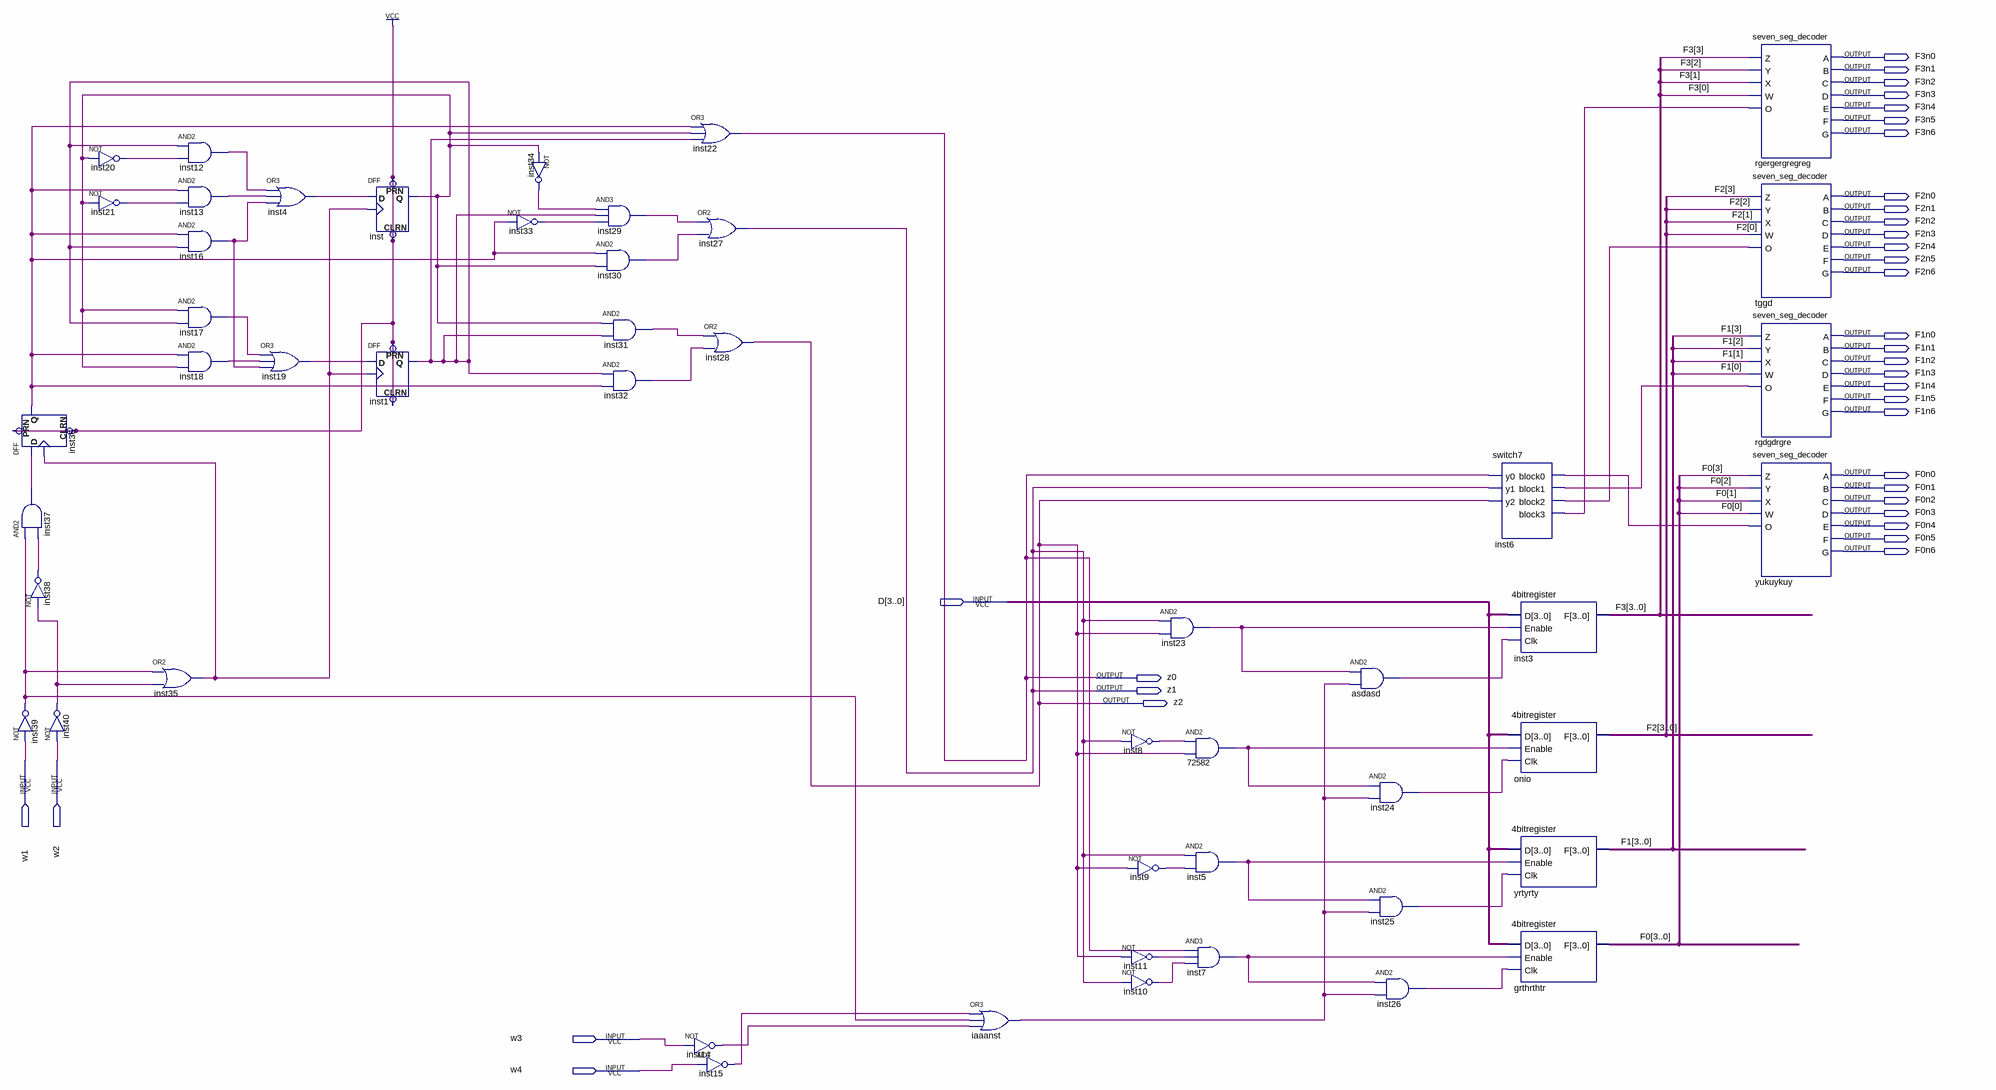
[diagram p0: schematic sheet]
// Quartus schematic DEC1.bdf as structural Verilog: 50 symbols, 36 pins
module DEC1 (
  input  [3:0] D,
  input  w1,
  input  w2,
  input  w3,
  input  w4,
  output F3n0,
  output F3n1,
  output F3n2,
  output F3n3,
  output F3n4,
  output F3n5,
  output F3n6,
  output F2n0,
  output F2n1,
  output F2n2,
  output F2n3,
  output F2n4,
  output F2n5,
  output F2n6,
  output F1n0,
  output F1n1,
  output F1n2,
  output F1n3,
  output F1n4,
  output F1n5,
  output F1n6,
  output F0n0,
  output F0n1,
  output F0n2,
  output F0n3,
  output F0n4,
  output F0n5,
  output F0n6,
  output z0,
  output z1,
  output z2
);

  wire asdasd_out, iaaanst_out, inst1_q, inst4_out, inst5_out, inst6_block0, inst6_block1, inst6_block2,
       inst6_block3, inst7_out, inst8_out, inst9_out, inst10_out, inst11_out, inst12_out, inst13_out,
       inst14_out, inst15_out, inst16_out, inst17_out, inst18_out, inst19_out, inst20_out, inst21_out,
       inst23_out, inst24_out, inst25_out, inst26_out, inst29_out, inst30_out, inst31_out, inst32_out,
       inst33_out, inst34_out, inst35_out, inst36_q, inst37_out, inst38_out, inst39_out, inst40_out, inst_q,
       n72582_out;
  wire [3:0] F0, F1, F2, F3;

  DFF inst36 (.CLRN(1'b1), .CLK(inst35_out), .D(inst37_out), .PRN(1'b1), .Q(inst36_q));
  and inst37 (inst37_out, inst39_out, inst38_out);
  not inst38 (inst38_out, inst40_out);
  not inst39 (inst39_out, w1);
  not inst20 (inst20_out, inst_q);
  not inst21 (inst21_out, inst_q);
  not inst40 (inst40_out, w2);
  and inst12 (inst12_out, inst1_q, inst20_out);
  and inst13 (inst13_out, inst36_q, inst21_out);
  and inst16 (inst16_out, inst36_q, inst1_q);
  and inst17 (inst17_out, inst_q, inst1_q);
  and inst18 (inst18_out, inst36_q, inst_q);
  or inst35 (inst35_out, inst39_out, inst40_out);
  or inst4 (inst4_out, inst12_out, inst13_out, inst16_out);
  or inst19 (inst19_out, inst17_out, inst18_out, inst16_out);
  DFF inst (.CLRN(1'b1), .CLK(inst35_out), .D(inst4_out), .PRN(1'b1), .Q(inst_q));
  DFF inst1 (.CLRN(1'b1), .CLK(inst35_out), .D(inst19_out), .PRN(1'b1), .Q(inst1_q));
  not inst34 (inst34_out, inst_q);
  not inst33 (inst33_out, inst36_q);
  and inst29 (inst29_out, inst34_out, inst1_q, inst33_out);
  and inst30 (inst30_out, inst36_q, inst_q);
  and inst31 (inst31_out, inst_q, inst1_q);
  and inst32 (inst32_out, inst1_q, inst36_q);
  or inst22 (z0, inst36_q, inst_q, inst1_q);
  or inst27 (z1, inst29_out, inst30_out);
  not inst14 (inst14_out, w3);
  not inst15 (inst15_out, w4);
  or inst28 (z2, inst31_out, inst32_out);
  or iaaanst (iaaanst_out, inst15_out, inst39_out, inst14_out);
  not inst8 (inst8_out, z1);
  not inst9 (inst9_out, z2);
  not inst11 (inst11_out, z2);
  not inst10 (inst10_out, z1);
  and inst23 (inst23_out, z1, z2);
  and u_72582 (n72582_out, inst8_out, z2);
  and inst5 (inst5_out, z1, inst9_out);
  and inst7 (inst7_out, z0, inst11_out, inst10_out);
  and asdasd (asdasd_out, inst23_out, iaaanst_out);
  and inst24 (inst24_out, n72582_out, iaaanst_out);
  and inst25 (inst25_out, inst5_out, iaaanst_out);
  and inst26 (inst26_out, inst7_out, iaaanst_out);
  switch7 inst6 (
    .y0(z0), .y1(z1), .y2(z2), .block0(inst6_block0), .block1(inst6_block1), .block2(inst6_block2),
    .block3(inst6_block3));
  \4bitregister  inst3 (.D(D), .Enable(inst23_out), .Clk(asdasd_out), .F(F3));
  \4bitregister  onio (.D(D), .Enable(n72582_out), .Clk(inst24_out), .F(F2));
  \4bitregister  yrtyrty (.D(D), .Enable(inst5_out), .Clk(inst25_out), .F(F1));
  \4bitregister  grthrthtr (.D(D), .Enable(inst7_out), .Clk(inst26_out), .F(F0));
  seven_seg_decoder rgergergregreg (
    .Z(F3[3]), .Y(F3[2]), .X(F3[1]), .W(F3[0]), .O(inst6_block3), .A(F3n0), .B(F3n1), .C(F3n2), .D(F3n3),
    .E(F3n4), .F(F3n5), .G(F3n6));
  seven_seg_decoder tggd (
    .Z(F2[3]), .Y(F2[2]), .X(F2[1]), .W(F2[0]), .O(inst6_block2), .A(F2n0), .B(F2n1), .C(F2n2), .D(F2n3),
    .E(F2n4), .F(F2n5), .G(F2n6));
  seven_seg_decoder rgdgdrgre (
    .Z(F1[3]), .Y(F1[2]), .X(F1[1]), .W(F1[0]), .O(inst6_block1), .A(F1n0), .B(F1n1), .C(F1n2), .D(F1n3),
    .E(F1n4), .F(F1n5), .G(F1n6));
  seven_seg_decoder yukuykuy (
    .Z(F0[3]), .Y(F0[2]), .X(F0[1]), .W(F0[0]), .O(inst6_block0), .A(F0n0), .B(F0n1), .C(F0n2), .D(F0n3),
    .E(F0n4), .F(F0n5), .G(F0n6));
endmodule
